# EAGLE schematic motorized_potentiometer (EAGLE 9.2.2)
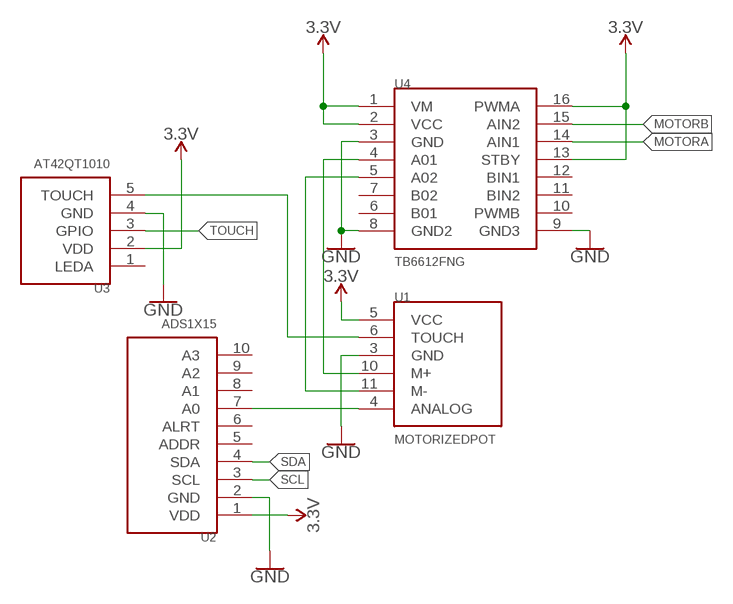
[diagram p0: schematic, sheet 1]

## Parts
U1  MOTORIZEDPOT  [MOTORIZEDPOT]
U2  ADS1X15  [ADS1X15]
U3  AT42QT1010  [AT42QT1010]
U4  TB6612FNG  [TB6612FNG]

## Nets
3.3V: U1.5(VCC) U2.1(VDD) U3.2(VDD) U4.1(VM) U4.2(VCC) U4.13(STBY) U4.16(PWMA)
GND: U1.3(GND) U2.2(GND) U3.4(GND) U4.3(GND) U4.8(GND2) U4.9(GND3)
MOTORA: U4.14(AIN1)
MOTORB: U4.15(AIN2)
N$2: U1.10(M+) U4.4(A01)
N$3: U1.11(M-) U4.5(A02)
N$4: U1.4(ANALOG) U2.7(A0)
N$5: U1.6(TOUCH) U3.5(TOUCH)
SCL: U2.3(SCL)
SDA: U2.4(SDA)
TOUCH: U3.3(GPIO)
Unconnected: U2.5(ADDR) U2.6(ALRT) U2.8(A1) U2.9(A2) U2.10(A3) U3.1(LEDA) U4.6(B01) U4.7(B02) U4.10(PWMB) U4.11(BIN2) U4.12(BIN1)

## Library data of the parts
U1 = motorizedpot:MOTORIZEDPOT
U2 = ads1X15:ADS1X15
U3 = AT42QT1010:AT42QT1010
U4 = tb6612fng:TB6612FNG